# EAGLE design SHIELD-EKG-EMG_Rev_B (EAGLE 5.02)
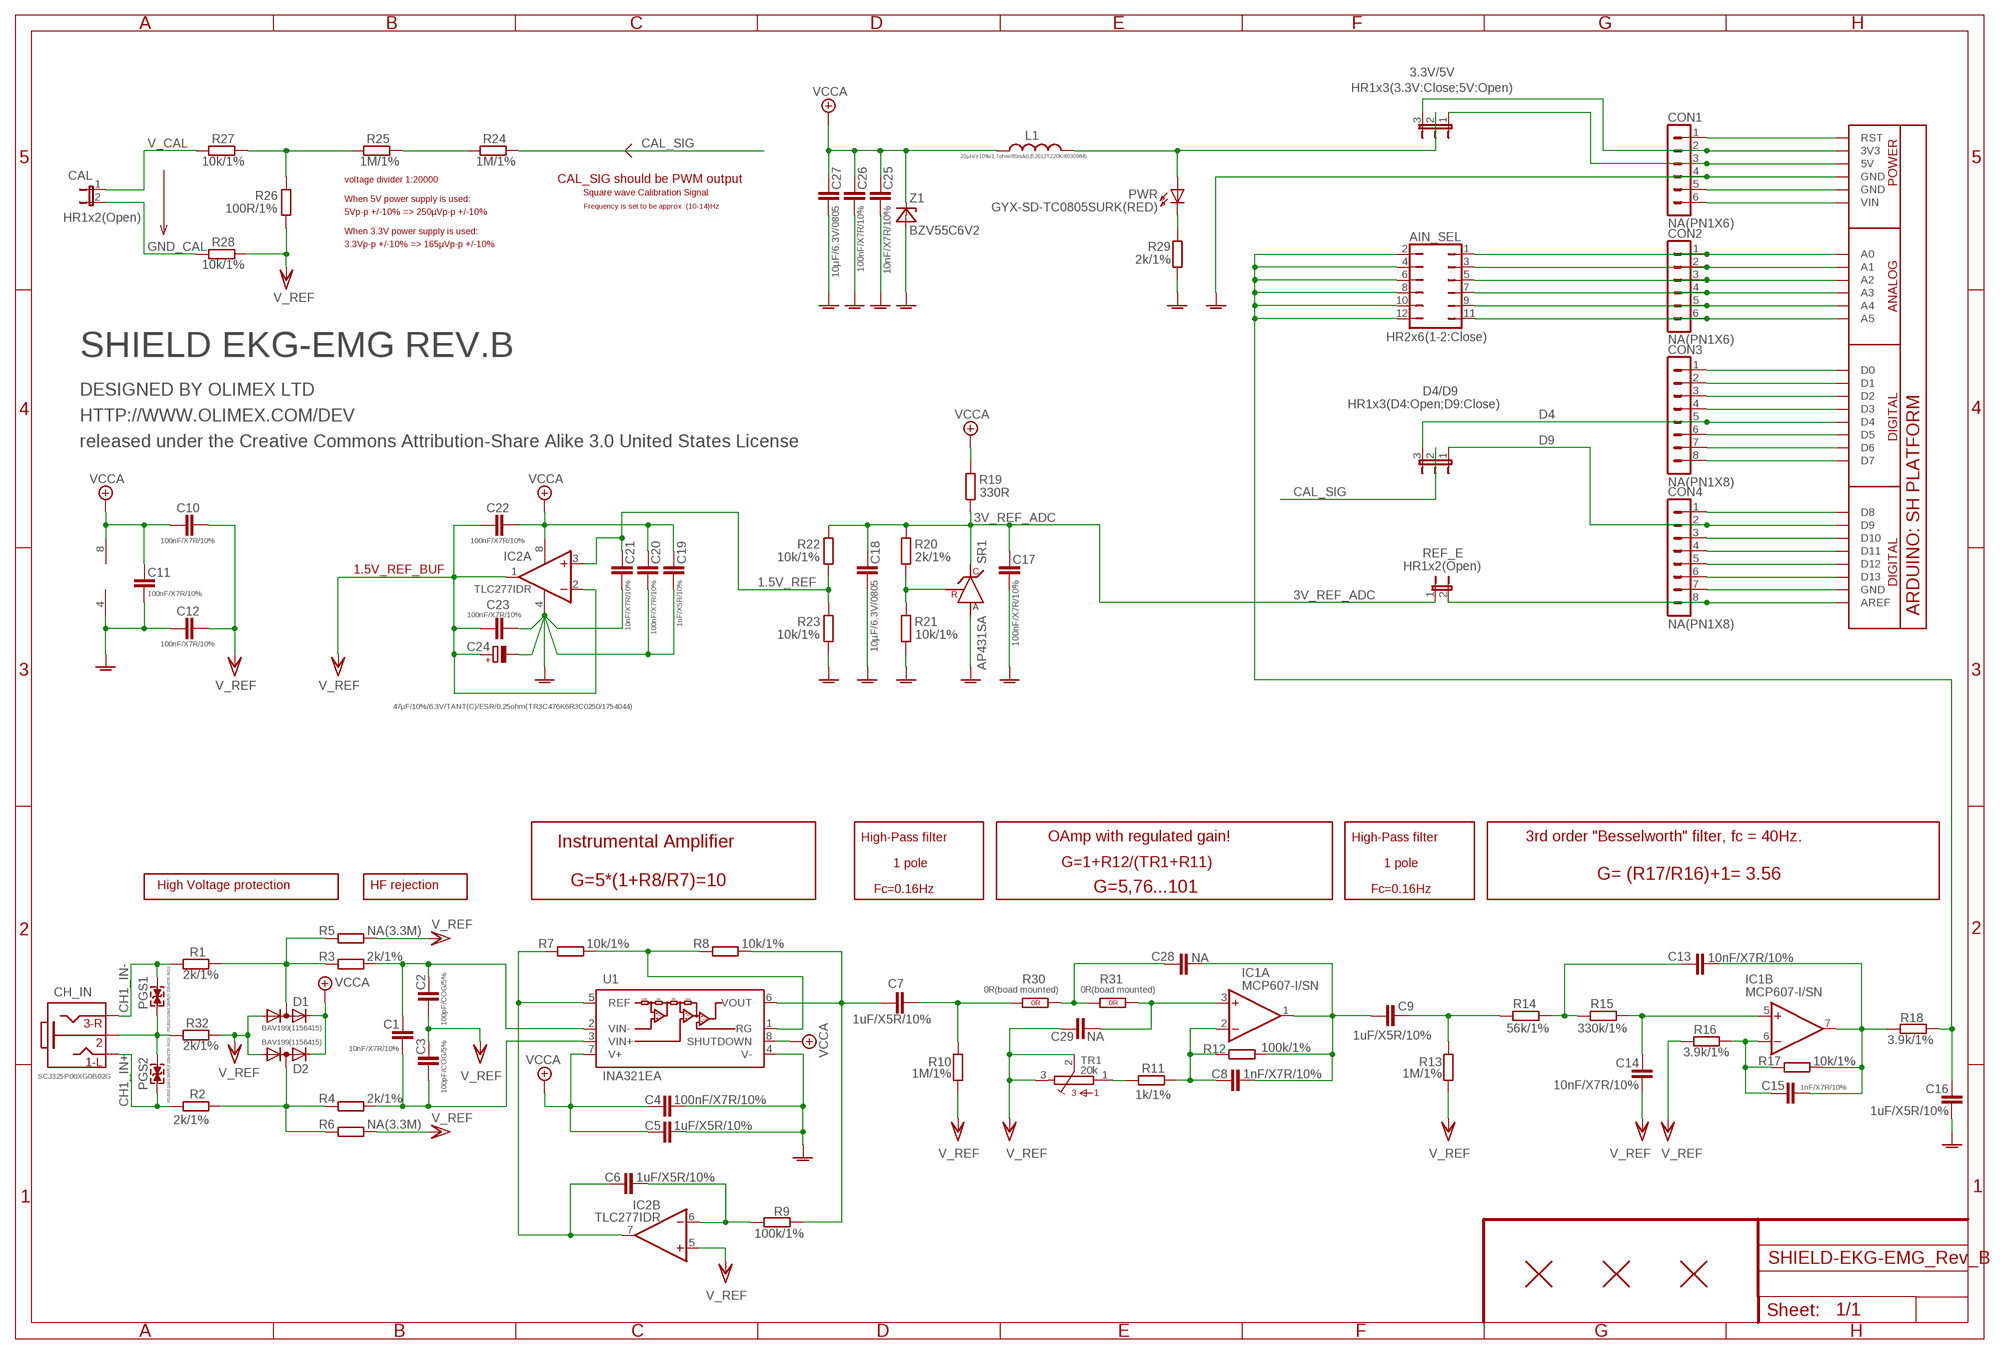
[diagram p0: schematic, sheet 1]

## Parts
3.3V/5V  HR1x3(3.3V:Close;5V:Open)  JP2EHR1X3  [HR1X3]
AIN_SEL  HR2x6(1-2:Close)  JP6QHR2X6  [HR2X6]
C1  10nF/X7R/10%  C-EUC0603_DWS  [C0603_DWS]
C2  100pF/COG/5%  C-EUC0603_DWS  [C0603_DWS]
C3  100pF/COG/5%  C-EUC0603_DWS  [C0603_DWS]
C4  100nF/X7R/10%  C-EUC0603_DWS  [C0603_DWS]
C5  1uF/X5R/10%  C-EUC0603_DWS  [C0603_DWS]
C6  1uF/X5R/10%  C-EUC0603_DWS  [C0603_DWS]
C7  1uF/X5R/10%  C-EUC0603_DWS  [C0603_DWS]
C8  1nF/X7R/10%  C-EUC0603_DWS  [C0603_DWS]
C9  1uF/X5R/10%  C-EUC0603_DWS  [C0603_DWS]
C10  100nF/X7R/10%  C-EUC0603_DWS  [C0603_DWS]
C11  100nF/X7R/10%  C-EUC0603_DWS  [C0603_DWS]
C12  100nF/X7R/10%  C-EUC0603_DWS  [C0603_DWS]
C13  10nF/X7R/10%  C-EUC0603_DWS  [C0603_DWS]
C14  10nF/X7R/10%  C-EUC0603_DWS  [C0603_DWS]
C15  1nF/X7R/10%  C-EUC0603_DWS  [C0603_DWS]
C16  1uF/X5R/10%  C-EUC0603_DWS  [C0603_DWS]
C17  100nF/X7R/10%  C-EUC0603_DWS  [C0603_DWS]
C18  10µF/6.3V/0805  C-EUC0805_5MIL_DWS  [C0805_5MIL_DWS]
C19  1uF/X5R/10%  C-EUC0603_DWS  [C0603_DWS]
C20  100nF/X7R/10%  C-EUC0603_DWS  [C0603_DWS]
C21  10nF/X7R/10%  C-EUC0603_DWS  [C0603_DWS]
C22  100nF/X7R/10%  C-EUC0603_DWS  [C0603_DWS]
C23  100nF/X7R/10%  C-EUC0603_DWS  [C0603_DWS]
C24  47µF/10%/6.3V/TANT(C)/ESR/0.25ohm(TR3C476K6R3C0250/1754044)  CPOL-EUCT6032  [CT6032]
C25  10nF/X7R/10%  C-EUC0603_DWS  [C0603_DWS]
C26  100nF/X7R/10%  C-EUC0603_DWS  [C0603_DWS]
C27  10µF/6.3V/0805  C-EUC0805_5MIL_DWS  [C0805_5MIL_DWS]
C28  NA  C-EUC0603_DWS_NA  [C0603_DWS_NA]
C29  NA  C-EUC0603_DWS_NA  [C0603_DWS_NA]
CAL  HR1x2(Open)  JP1EHR1X2  [JP1R]
CH_IN  SCJ325P00XG0B02G  JACK-3PINSCJ325P00XG0B02G  [PHONE_JACK-SMD]
CON1  NA(PN1X6)  CON6PN1X6  [PN1X6]
CON2  NA(PN1X6)  CON6PN1X6  [PN1X6]
CON3  NA(PN1X8)  CON8PN1X8  [PN1X8]
CON4  NA(PN1X8)  CON8PN1X8  [PN1X8]
D1  BAV199(1156415)  DIODE_AC-AC_  [SOT23C(BAT54S)]
D2  BAV199(1156415)  DIODE_AC-AC_  [SOT23C(BAT54S)]
D4/D9  HR1x3(D4:Open;D9:Close)  JP2EHR1X3  [HR1X3]
IC1  MCP607-I/SN  LM358D  [SO08]
IC2  TLC277IDR  LM358D  [SO08]
L1  22µH/±10%/1.7ohm/80mA(LB2012T220K/8030984)  L-USL0805_5MIL_DWS  [L0805_5MIL_DWS]
PGS1  PGB1010603MR(F2594TR-ND)  [0603]
PGS2  PGB1010603MR(F2594TR-ND)  [0603]
PWR  GYX-SD-TC0805SURK(RED)  LED0805DWS  [LED-0805]
R1  2k/1%  R-EU_R0603_5MIL_DWS  [R0603_5MIL_DWS]
R2  2k/1%  R-EU_R0603_5MIL_DWS  [R0603_5MIL_DWS]
R3  2k/1%  R-EU_R0603_5MIL_DWS  [R0603_5MIL_DWS]
R4  2k/1%  R-EU_R0603_5MIL_DWS  [R0603_5MIL_DWS]
R5  NA(3.3M)  R-EU_R0603_5MIL_DWS_NA  [R0603_5MIL_DWS_NA]
R6  NA(3.3M)  R-EU_R0603_5MIL_DWS_NA  [R0603_5MIL_DWS_NA]
R7  10k/1%  R-EU_R0603_5MIL_DWS  [R0603_5MIL_DWS]
R8  10k/1%  R-EU_R0603_5MIL_DWS  [R0603_5MIL_DWS]
R9  100k/1%  R-EU_R0603_5MIL_DWS  [R0603_5MIL_DWS]
R10  1M/1%  R-EU_R0603_5MIL_DWS  [R0603_5MIL_DWS]
R11  1k/1%  R-EU_R0603_5MIL_DWS  [R0603_5MIL_DWS]
R12  100k/1%  R-EU_R0603_5MIL_DWS  [R0603_5MIL_DWS]
R13  1M/1%  R-EU_R0603_5MIL_DWS  [R0603_5MIL_DWS]
R14  56k/1%  R-EU_R0603_5MIL_DWS  [R0603_5MIL_DWS]
R15  330k/1%  R-EU_R0603_5MIL_DWS  [R0603_5MIL_DWS]
R16  3.9k/1%  R-EU_R0603_5MIL_DWS  [R0603_5MIL_DWS]
R17  10k/1%  R-EU_R0603_5MIL_DWS  [R0603_5MIL_DWS]
R18  3.9k/1%  R-EU_R0603_5MIL_DWS  [R0603_5MIL_DWS]
R19  330R  R-EU_R0603_5MIL_DWS  [R0603_5MIL_DWS]
R20  2k/1%  R-EU_R0603_5MIL_DWS  [R0603_5MIL_DWS]
R21  10k/1%  R-EU_R0603_5MIL_DWS  [R0603_5MIL_DWS]
R22  10k/1%  R-EU_R0603_5MIL_DWS  [R0603_5MIL_DWS]
R23  10k/1%  R-EU_R0603_5MIL_DWS  [R0603_5MIL_DWS]
R24  1M/1%  R-EU_R0603_5MIL_DWS  [R0603_5MIL_DWS]
R25  1M/1%  R-EU_R0603_5MIL_DWS  [R0603_5MIL_DWS]
R26  100R/1%  R-EU_R0603_5MIL_DWS  [R0603_5MIL_DWS]
R27  10k/1%  R-EU_R0603_5MIL_DWS  [R0603_5MIL_DWS]
R28  10k/1%  R-EU_R0603_5MIL_DWS  [R0603_5MIL_DWS]
R29  2k/1%  R-EU_R0603_5MIL_DWS  [R0603_5MIL_DWS]
R30  0R(boad mounted)  R_0R0R(NA)  [0603_0R]
R31  0R(boad mounted)  R_0R0R(NA)  [0603_0R]
R32  2k/1%  R-EU_R0603_5MIL_DWS  [R0603_5MIL_DWS]
REF_E  HR1x2(Open)  JP1EHR1X2  [JP1R]
SR1  AP431SA  TL431'''  [SOT-23]
TR1  20k  S64Y  [S64Y]
U1  INA321EA  [MSOP8]
U2  2xPN1x6/8.5/11+2xPN1x8/8.5/11  ARDUINO_SH_PLATFORM1  [ARDUINO_SHIELD_PLATFORM]
U$5  FIDUCIAL1X2  [FIDUCIAL-1X2]
U$6  FIDUCIAL1X2  [FIDUCIAL-1X2]
U$7  FIDUCIAL1X2  [FIDUCIAL-1X2]
Z1  BZV55C6V2  ZDIOD-SMD  [MINI-MELF]

## Nets
1.5V_REF: C21.1 IC2.3(A:+IN) R22.1 R23.2
3V_REF_ADC: C17.1 C18.1 R19.1 R20.2 R22.2 REF_E.1 SR1.1(C)
+5V: C4.1 C5.1 C10.1 C11.1 C19.1 C20.1 C22.2 C25.1 C26.1 C27.1 D1.2(K) D2.2(K) IC1.8(P:V+) IC2.8(P:V+) L1.2 R19.2 U1.7(V+) U1.8(SHUTDOWN) Z1.1(C) ; supply symbol labelled VCCA
ADC0: AIN_SEL.2 AIN_SEL.4 AIN_SEL.6 AIN_SEL.8 AIN_SEL.10 AIN_SEL.12 C16.1 R18.1
CAL_SIG: D4/D9.2 R24.2
CH1_IN+: CH_IN.5 PGS2.1 R2.1
CH1_IN-: CH_IN.2 PGS1.2 R1.1
D4: CON3.5 D4/D9.3 U2.D4
D9: CON4.2 D4/D9.1 U2.D9
GND_CAL: CAL.2 R28.1
GNDA [pwr]: C4.2 C5.2 C11.2 C12.1 C16.2 C17.2 C18.2 C19.2 C20.2 C21.2 C23.2 C24.- C25.2 C26.2 C27.2 CON1.4 IC1.4(P:V-) IC2.4(P:V-) R21.1 R23.1 R29.1 SR1.3(A) U1.4(V-) U2.GND Z1.2(A)
N$1: CON4.8 REF_E.2 U2.AREF
N$2: 3.3V/5V.3 CON1.2 U2.3V3
N$3: 3.3V/5V.1 CON1.3 U2.5V
N$4: 3.3V/5V.2 L1.1 PWR.A
N$5: CON1.1 U2.RST
N$6: CON1.5 U2.GND@1(GND)
N$7: D1.3(AK) R1.2 R3.2 R5.2
N$8: D2.3(AK) R2.2 R4.2 R6.2
N$9: C6.2 IC2.7(B:OUT) R7.2 U1.5(REF)
N$10: R7.1 R8.2 U1.1(RG)
N$11: CON1.6 U2.VIN
N$12: CON3.1 U2.D0
N$14: AIN_SEL.1 CON2.1 U2.A0
N$15: PWR.C R29.2
N$16: CON3.2 U2.D1
N$17: CON3.3 U2.D2
N$18: CON3.4 U2.D3
N$19: AIN_SEL.3 CON2.2 U2.A1
N$20: C7.2 R10.1 R30.1(1.1)
N$21: CON3.6 U2.D5
N$22: R20.1 R21.2 SR1.2(R)
N$23: CON3.7 U2.D6
N$24: CON3.8 U2.D7
N$25: CON4.1 U2.D8
N$26: CON4.3 U2.D10
N$27: CON4.4 U2.D11
N$28: CON4.5 U2.D12
N$29: R11.2 TR1.1
N$30: CON4.6 U2.D13
N$31: AIN_SEL.5 CON2.3 U2.A2
N$32: AIN_SEL.7 CON2.4 U2.A3
N$33: AIN_SEL.9 CON2.5 U2.A4
N$34: AIN_SEL.11 CON2.6 U2.A5
N$35: CON4.7 U2.GND@2(GND)
N$36: C28.1 R30.2(1.2) R31.1(1.1)
N$37: CH_IN.1 PGS1.1 PGS2.2 R32.1
N$81: C9.2 R13.1 R14.1
N$83: C7.1 R8.1 R9.2 U1.6(VOUT)
N$92: C1.1 C3.1 R4.1 U1.3(VIN+)
N$93: C1.2 C2.2 R3.1 U1.2(VIN-)
N$102: C29.1 IC1.3(A:+IN) R31.2(1.2)
N$104: C8.2 C9.1 C28.2 IC1.1(A:OUT) R12.2
N$105: C8.1 IC1.2(A:-IN) R11.1 R12.1
N$107: C14.1 IC1.5(B:+IN) R15.2
N$108: C13.1 R14.2 R15.1
N$109: C13.2 C15.2 IC1.7(B:OUT) R17.2 R18.2
N$110: C15.1 IC1.6(B:-IN) R16.1 R17.1
N$144: R24.1 R25.2
N$145: C6.1 IC2.6(B:-IN) R9.1
N$146: R25.1 R26.2 R27.2
V_CAL: CAL.1 R27.1
VCC/2: C2.1 C3.2 C10.2 C12.2 C14.2 C22.1 C23.1 C24.+ C29.2 D1.1(A) D2.1(A) IC2.1(A:OUT) IC2.2(A:-IN) IC2.5(B:+IN) R5.1 R6.1 R10.2 R13.2 R16.2 R26.1 R28.2 R32.2 TR1.2 TR1.3 ; supply symbol labelled V_REF

## Notes on the sheet
- voltage divider 1:20000 | CAL_SIG should be PWM output
- Square wave Calibration Signal
- When 5V power supply is used:
- Frequency is set to be approx: (10-14)Hz
- 5Vp-p +/-10% => 250µVp-p +/-10%
- When 3.3V power supply is used:
- 3.3Vp-p +/-10% => 165µVp-p +/-10%
- SHIELD EKG-EMG REV.B
- DESIGNED BY OLIMEX LTD
- HTTP://WWW.OLIMEX.COM/DEV
- released under the Creative Commons Attribution-Share Alike 3.0 United States License
- 1.5V_REF_BUF
- High-Pass filter | OAmp with regulated gain! | High-Pass filter | 3rd order "Besselworth" filter, fc = 40Hz.
- Instrumental Amplifier
- 1 pole | G=1+R12/(TR1+R11) | 1 pole
- High Voltage protection | HF rejection | G= (R17/R16)+1= 3.56
- G=5*(1+R8/R7)=10
- Fc=0.16Hz | G=5,76...101 | Fc=0.16Hz

## Library data of the parts
3.3V/5V D4/D9 = jumper:JP2E: JUMPER
AIN_SEL = jumper:JP6Q: JUMPER
C1-C23 C25-C29 = rcl:C-EU: CAPACITOR, European symbol
C24 = rcl:CPOL-EU: POLARIZED CAPACITOR, European symbol
CAL REF_E = jumper:JP1E: JUMPER
CH_IN = gogo:JACK-3PIN
CON1 CON2 = Penko:CON6: CONNECTORS - 6 PINS
CON3 CON4 = Penko:CON8
D1 D2 = semicon-smd-ipc:DIODE_AC-AC_: DUAL DIODE
IC1 IC2 = linear:LM358: OP AMP
L1 = rcl:L-US: INDUCTOR, American symbol
PGS1 PGS2 = OLIMEX_DISCRET:PGB1010603MR: PulseGuard® Suppressors Surface Mount Polymeric ESD Suppressors
PWR = DOUBLE-SIDE:LED
R1-R29 R32 = rcl:R-EU_: RESISTOR, European symbol
R30 R31 = OLIMEX_DISCRET:R_0R
SR1 = OLIMEX_IC:TL431: TL431 Programmable Shunt Regulator Features: -> Programmable Output Voltage to 36 Volts -> Low Dynamic Output Impedance 0.20 Typical -> Sink Current Capability of 1.0 to 100mA -> Equivalent Full-Range Temperature Coefficient of 50ppm/°C Typical -> Temperature Compensated For Operation Over Full Rated Operating Temperature Range -> Low Output Noise Voltage -> Fast Turn-on Response
TR1 = TRIMPOT:S64Y
U1 = OLIMEX_IC:INA321
U2 = OLIMEX_CASES:ARDUINO_SH_PLATFORM
U$5-U$7 = SparkFunEagle-6-6-07:FIDUCIAL: Fiducial Alignment Points Various fiducial points for machine vision alignment.
Z1 = gogo:ZDIOD-SMD

## Net classes
1 pwr: width 0.4 mm, drill 0.6 mm, clearance 0.23 mm

## Board
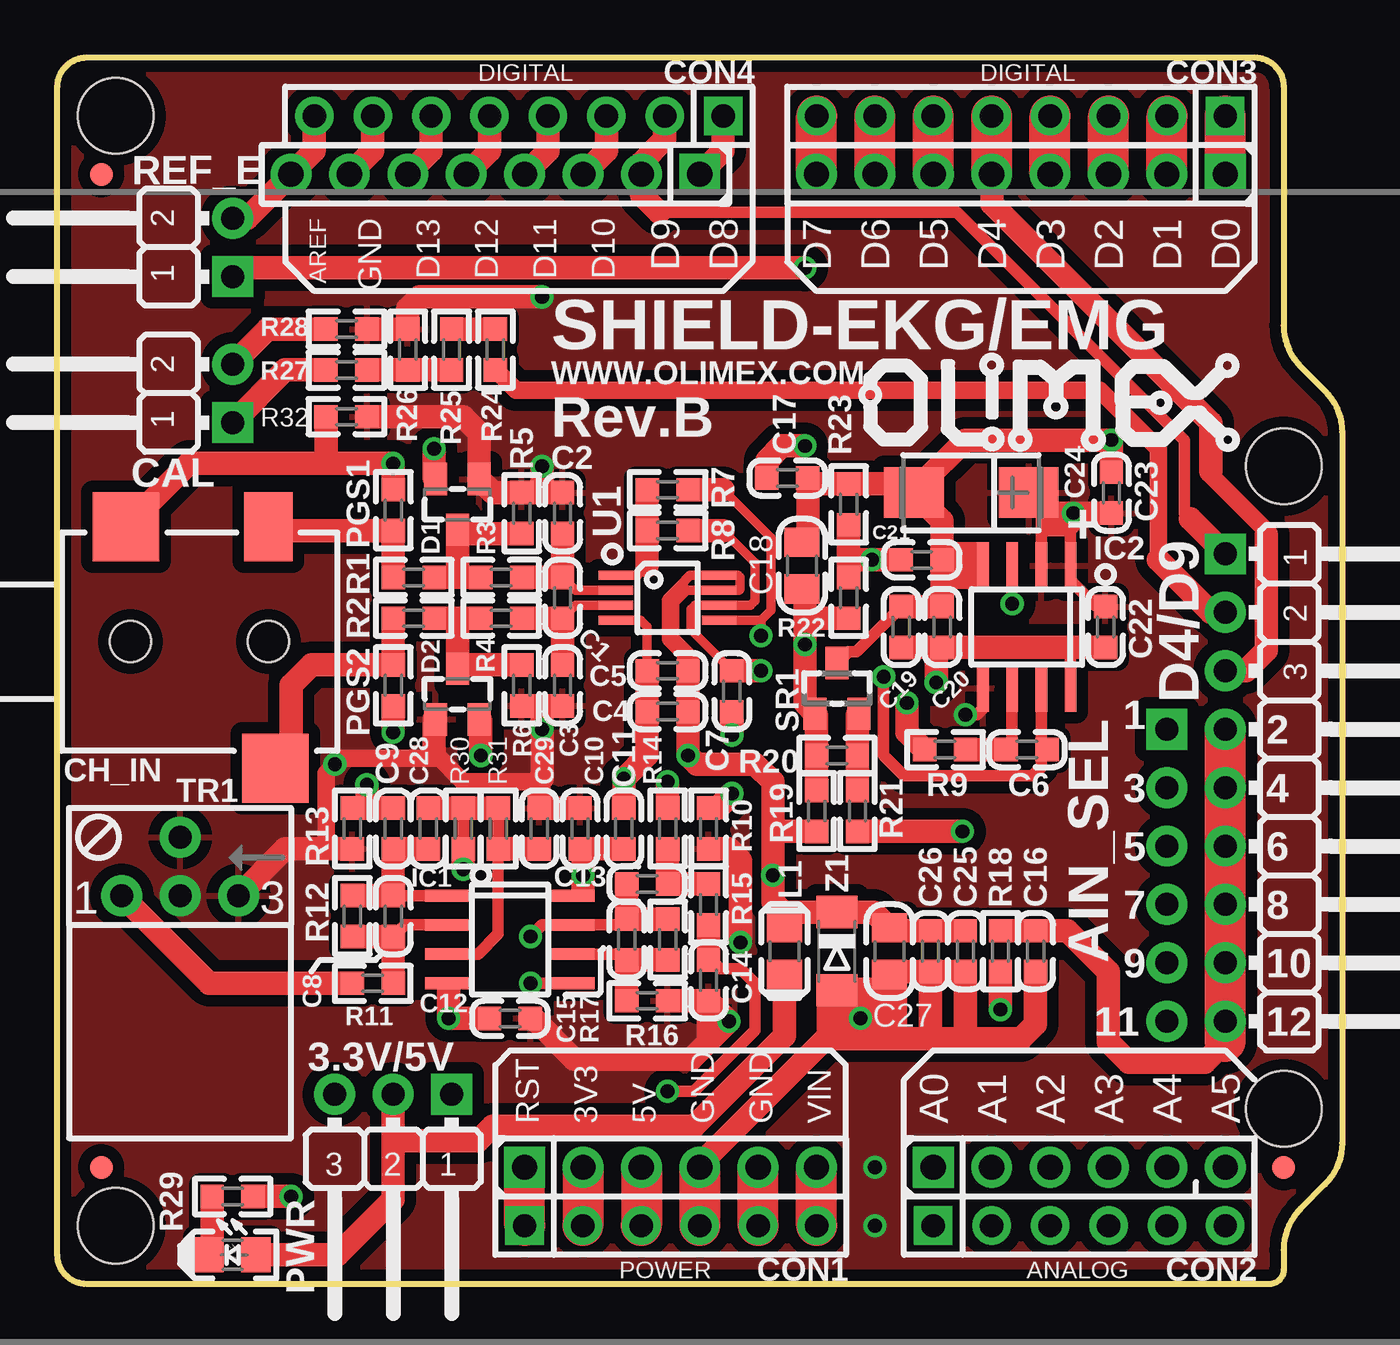
[diagram p1: board, top side]
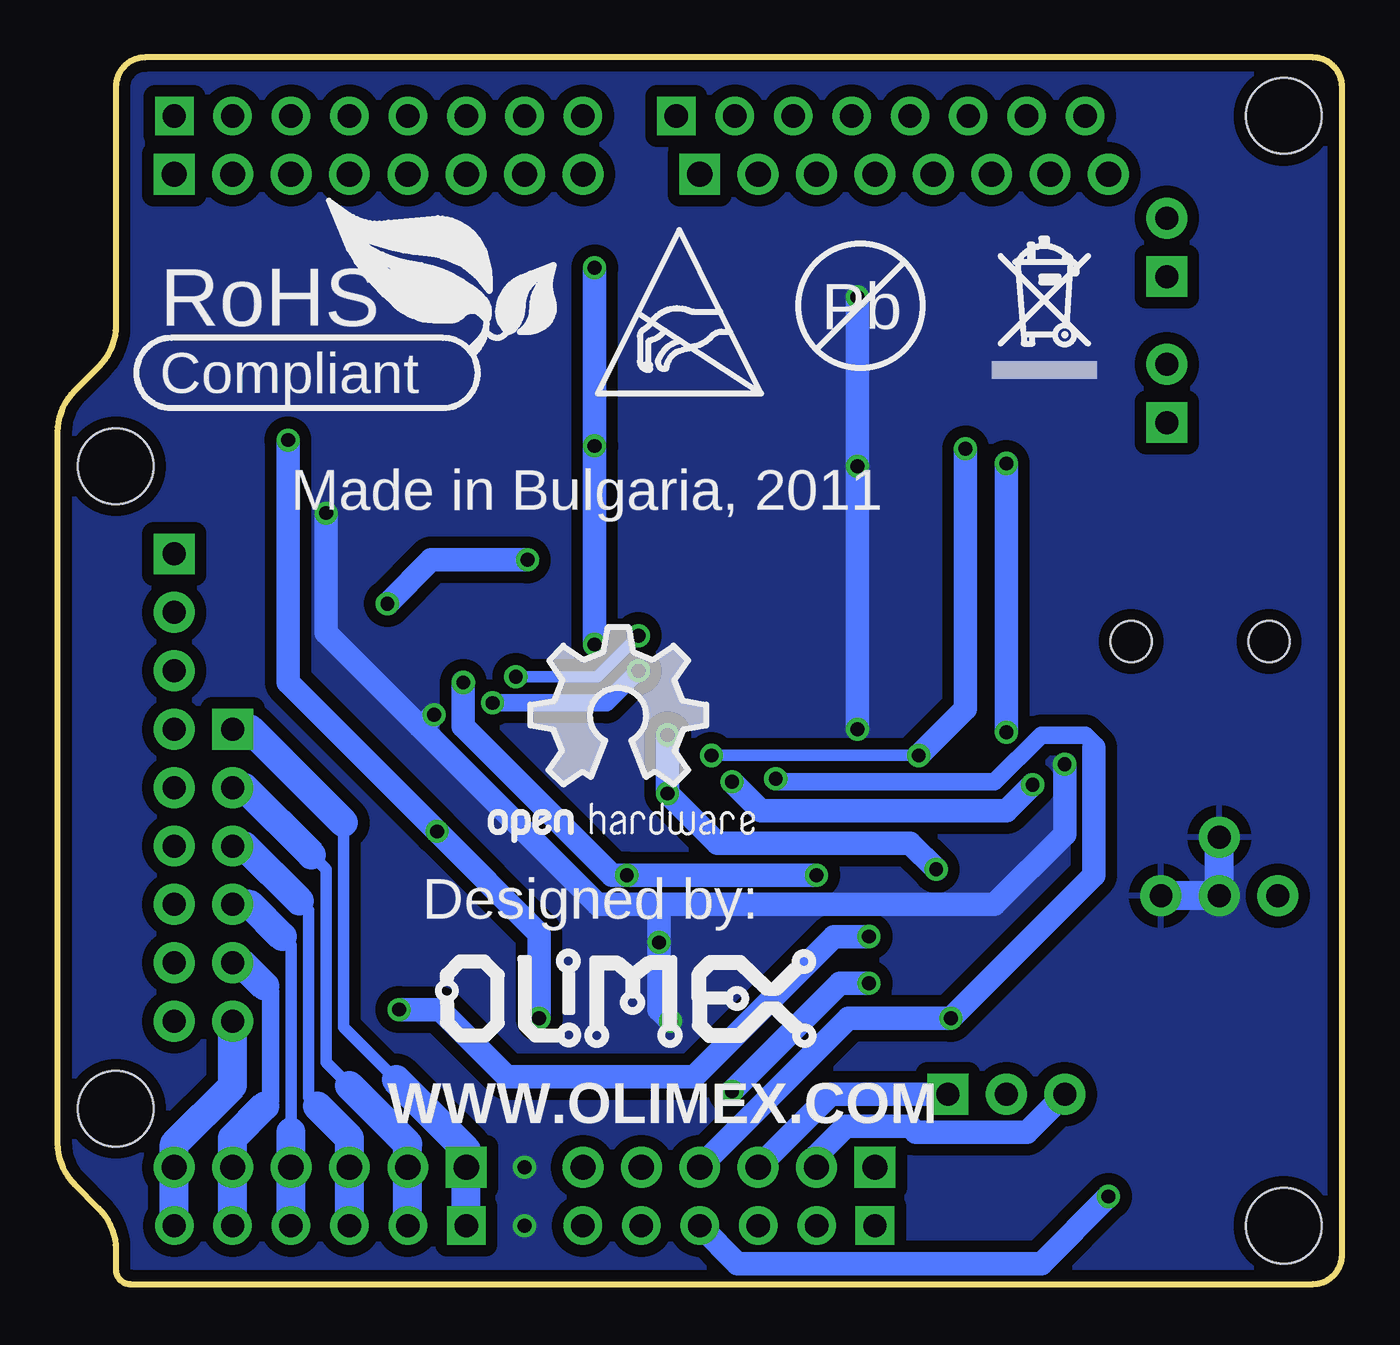
[diagram p2: board, bottom side, seen from below]

Size 55.88 x 53.34 mm. Coordinates in mm from the lower left corner, seen from the top.
Copper layers (1+16): Top 0.035mm / dielectric 1.5mm / Bottom 0.035mm
Design rules "default": minimum track width 10mil, minimum drill 0.6mm, track to track 9.5mil, track to pad 9.5mil, pad to pad 9.5mil, via to via 10mil, smd to smd 1mil, copper to edge 10mil, drill to drill 10mil, minimum pad ring 10mil, minimum via ring 8mil, stop-mask expansion 4mil, vias tented up to drill 25mil, thermal gap 20mil

### Footprints (pad centres in the part's own frame; a part is rotated, then mirrored left to right if it is on the bottom)
HR1X3 = drill 1 pad 1.778 square: 1 -2.54,0 | drill 1 pad 1.778 round: 2 0,0; 3 2.54,0
HR2X6 = drill 1 pad 1.778 square: 1 -6.35,-1.27 | drill 1 pad 1.778 round: 2 -6.35,1.27; 3 -3.81,-1.27; 4 -3.81,1.27; 5 -1.27,-1.27; 6 -1.27,1.27; 7 1.27,-1.27; 8 1.27,1.27; 9 3.81,-1.27; 10 3.81,1.27; 11 6.35,-1.27; 12 6.35,1.27
C0603_DWS = smd 1.016 x 1.016: 1 -0.889,0; 2 0.889,0
C0805_5MIL_DWS = smd 1.27 x 1.524: 1 -1.016,0; 2 1.016,0
CT6032 = smd 2.6 x 2.2: + -2.5,0; - 2.5,0
C0603_DWS_NA = smd 1.016 x 1.016: 1 -0.889,0; 2 0.889,0
JP1R = drill 1 pad 1.778 square: 1 -1.27,0 | drill 1 pad 1.778 round: 2 1.27,0
PHONE_JACK-SMD = smd 2.9 x 3: 1 -0.2,5; 5 6.3,-5.5 | smd 2.1 x 3: 2 6,5 | hole 1.8: 0,0; 6,0
PN1X6 = drill 1.1 pad 1.778 square: 1 -6.35,0 | drill 1.1 pad 1.778 round: 2 -3.81,0; 3 -1.27,0; 4 1.27,0; 5 3.81,0; 6 6.35,0
PN1X8 = drill 1.1 pad 1.778 square: 1 -8.89,0 | drill 1.1 pad 1.778 round: 2 -6.35,0; 3 -3.81,0; 4 -1.27,0; 5 1.27,0; 6 3.81,0; 7 6.35,0; 8 8.89,0
SOT23C(BAT54S) = smd 1 x 1.4: 1 -0.95,-1.1; 2 0.95,-1.1; 3 0,1.1
SO08 = smd 0.508 x 2.032: 1 -1.905,-2.667; 2 -0.635,-2.667; 3 0.635,-2.667; 4 1.905,-2.667; 5 1.905,2.667; 6 0.635,2.667; 7 -0.635,2.667; 8 -1.905,2.667
L0805_5MIL_DWS = smd 1.27 x 1.524: 1 -1.016,0; 2 1.016,0
0603 = smd 1.016 x 1.016: 1 -0.889,0; 2 0.889,0
LED-0805 = smd 1.27 x 1.524: A 1.016,0; C -1.016,0
R0603_5MIL_DWS = smd 1.016 x 1.016: 1 -0.889,0; 2 0.889,0
R0603_5MIL_DWS_NA = smd 1.016 x 1.016: 1 -0.889,0; 2 0.889,0
0603_0R = smd 1.016 x 1.016: 1 -0.889,0; 2 0.889,0
SOT-23 = smd 1 x 1.4: 1 -0.95,-1.1; 2 0.95,-1.1; 3 0,1.1
S64Y = drill 0.991 pad 1.778 round: 1 2.54,1.27; 2 0,-1.27; 3 -2.54,1.27
MSOP8 = smd 0.4 x 1.5: 1 -0.975,-2.25; 2 -0.325,-2.25; 3 0.325,-2.25; 4 0.975,-2.25; 5 0.975,2.25; 6 0.325,2.25; 7 -0.325,2.25; 8 -0.975,2.25
ARDUINO_SHIELD_PLATFORM = drill 1.016 pad 1.676 round: 3V3 22.86,2.54; 5V 25.4,2.54; A1 40.64,2.54; A2 43.18,2.54; A3 45.72,2.54; A4 48.26,2.54; A5 50.8,2.54; AREF 11.176,50.8; D1 48.26,50.8; D2 45.72,50.8; D3 43.18,50.8; D4 40.64,50.8; D5 38.1,50.8; D6 35.56,50.8; D7 33.02,50.8; D9 26.416,50.8; D10 23.876,50.8; D11 21.336,50.8; D12 18.796,50.8; D13 16.256,50.8; GND 27.94,2.54; GND@1 30.48,2.54; GND@2 13.716,50.8; VIN 33.02,2.54 | drill 1.016 pad 1.676 square: A0 38.1,2.54; D0 50.8,50.8; D8 28.956,50.8; RST 20.32,2.54 | hole 3.3: 53.34,35.56; 53.34,7.62; 2.54,50.8; 2.54,2.54
FIDUCIAL-1X2 = smd 1 x 1: 1 0,0
MINI-MELF = smd 1.4 x 1.8: 1 -1.7,0; 2 1.7,0

### Placement (x,y rotation side)
3.3V/5V  14.61,8.26 180 top
AIN_SEL  49.53,17.78 270 top
C1  21.97,29.84 90 top
C2  21.97,33.53 270 top
C3  21.97,26.04 270 top
C4  26.54,24.89 180 top
C5  26.54,26.67 180 top
C6  42.16,23.24 0 top
C7  29.34,25.78 270 top
C8  14.61,16 90 top
C9  14.61,19.81 90 top
C10  22.73,19.81 90 top
C11  24.64,19.81 90 top
C12  19.68,11.56 0 top
C13  25.65,17.4 180 top
C14  28.32,13.21 270 top
C15  24.77,14.99 90 top
C16  42.55,14.48 270 top
C17  31.75,35.05 0 top
C18  32.38,31.24 90 top
C19  36.7,28.57 90 top
C20  38.48,28.57 90 top
C21  37.59,31.5 0 top
C22  45.59,28.57 270 top
C23  45.85,34.42 90 top
C24  39.75,34.42 180 top
C25  39.5,14.48 270 top
C26  37.97,14.48 270 top
C27  36.2,14.48 270 top
C28  16.13,19.81 270 top
C29  20.95,19.81 90 top
CAL  7.62,38.73 90 top
CH_IN  3.17,27.94 0 top
CON1  26.67,5.08 0 top
CON2  44.45,5.08 0 top
CON3  41.91,48.26 180 top
CON4  19.05,48.26 180 top
D1  17.4,33.91 180 top
D2  17.4,25.65 0 top
D4/D9  50.8,29.21 270 top
IC1  19.68,14.99 270 top
IC2  42.16,28.57 180 top
L1  31.62,14.48 90 top
PGS1  14.61,33.66 270 top
PGS2  14.61,26.04 270 top
PWR  7.62,1.27 0 top
R1  15.49,30.73 0 top
R2  15.49,28.96 0 top
R3  19.3,30.73 180 top
R4  19.3,28.96 180 top
R5  20.19,33.53 270 top
R6  20.19,26.04 90 top
R7  26.54,34.54 0 top
R8  26.54,32.77 180 top
R9  38.61,23.24 180 top
R10  28.32,19.81 270 top
R11  13.72,13.08 180 top
R12  12.83,16 90 top
R13  12.83,19.81 270 top
R14  26.54,19.81 270 top
R15  28.32,16.51 270 top
R16  25.65,12.32 0 top
R17  26.54,14.99 90 top
R18  41.02,14.48 270 top
R19  33.02,20.57 270 top
R20  33.91,22.99 180 top
R21  34.8,20.57 90 top
R22  34.42,29.84 270 top
R23  34.42,33.91 270 top
R24  19.05,40.64 270 top
R25  17.14,40.64 90 top
R26  15.24,40.64 270 top
R27  12.57,39.75 0 top
R28  12.57,41.53 0 top
R29  7.62,3.81 180 top
R30  17.65,19.81 90 top
R31  19.18,19.81 270 top
R32  12.57,37.72 0 top
REF_E  7.62,45.09 90 top
SR1  33.91,25.91 0 top
TR1  5.33,18.16 180 top
U1  26.54,29.84 270 top
U2  0,0 0 top
U$2  [OLIMEX1_V]  52.58,36.07 0 top
U$4  [ESD_SYMBOL]  32.38,38.73 0 bottom
U$5  53.34,5.08 0 top
U$6  1.91,5.08 0 top
U$7  1.91,48.26 0 top
U$8  [OLIMEX1_V]  21.72,10.16 0 bottom
U$9  [LOGO-OPENHARDWARE_8X8]  31.5,24.64 0 bottom
U$11  [PB]  20.95,42.55 0 bottom
U$13  [RECYCLE_BIN1/8]  15.24,39.37 0 bottom
U$14  [ROHS]  51.44,38.73 0 bottom
Z1  33.91,14.48 270 top

### Tracks (layer width: path | path; a pad name or v marks a point on that pad's centre or on a via)
1.5V_REF  (via drill 0.6)
  Top 0.508: v41.53,29.59 IC2.3
  Top 1.016: C21.1 v35.43,31.5 34.42,31.5 | 34.42,31.5 R23.2 | R22.1 34.42,31.5
  Bottom 1.016: v35.43,31.5 39.62,31.5 v41.53,29.59
3V_REF_ADC  (via drill 0.6)
  Top 0.61: SR1.1 33.02,24.75
  Top 1.016: R19.1 R20.2 33.02,24.75 | 32.51,28.96 R22.2 | SR1.1 32.96,24.83 32.51,25.27 v32.51,27.81 32.51,28.96 | v32.51,36.45 31.5,36.45 30.86,35.81 C17.1 | 32.51,28.96 32.51,30.23 C18.1 | REF_E.1 8,44.2 v32.51,44.2
  Bottom 1.016: v32.51,27.81 v32.51,36.45 v32.51,44.2
+5V  (via drill 0.6, 0.6 pad 0.81)
  Top 0.305: IC1.8 22.86,16.89 22.86,17.14
  Top 0.406: 27.12,30.17 U1.7 29.64,30.17 29.69,30.23 29.69,30.73 29.61,30.82 U1.8 27.52,30.82 27.05,30.35
  Top 0.508: 44.07,27.69 IC2.8
  Top 0.762: 27.12,30.17 26.67,29.72 26.67,28.07 27.43,27.3 27.43,27.05
  Top 0.813: 31.62,16.13 31.67,16.18
  Top 1.016: 22.86,18.92 C11.1 | C25.1 C26.1 36.2,15.37 C27.1 35.51,16.18 Z1.1 31.67,16.18 | v16.38,36.32 16.38,35.08 D1.2 | 22.86,17.14 v22.86,17.78 22.86,18.92 | L1.2 31.62,16.13 31.11,16.64 v31.11,17.78 31.11,19.68 | 22.86,18.92 C10.1 | 27.43,27.05 C5.1 C4.1 v27.43,22.99 27.81,22.61 30.35,22.61 31.11,21.84 31.11,19.68 | 31.11,19.68 R19.2 | v38.23,26.16 38.23,27.69 | 38.23,27.69 C20.1 44.07,27.69 C22.2 | 38.23,27.69 C19.1 | D2.2 18.39,24.51 18.41,24.51 v18.41,22.99
  Bottom 0.508: v27.43,22.99 v18.41,22.99
  Bottom 1.016: v22.86,17.78 v31.11,17.78 31.75,17.78 38.23,24.26 v38.23,26.16 | v18.41,22.99 16.38,25.02 v16.38,36.32
ADC0
  Top 1.016: 50.8,10.54 49.91,9.65 46.61,9.65 45.72,10.54 45.72,13.59 43.94,15.37 C16.1 R18.1
  Top 1.778: AIN_SEL.2 AIN_SEL.4 AIN_SEL.6 AIN_SEL.8 AIN_SEL.10 AIN_SEL.12 50.8,10.54
CAL_SIG
  Top 0.762: 47.88,31.5 47.88,36.32 45.34,38.86 19.94,38.86 R24.2
  Top 1.016: D4/D9.2 50.16,29.21 47.88,31.5
CH1_IN+
  Top 1.016: R2.1 PGS2.1 11.05,26.92 10.16,26.04 10.16,22.44 CH_IN.5
CH1_IN-
  Top 1.016: R1.1 PGS1.2 9.18,32.77 CH_IN.2
D4
  Top 0.762: 52.58,32.59 52.58,32.77 50.16,35.18 50.16,35.36
  Top 1.016: D4/D9.3 51.69,26.67 52.58,27.56 52.58,32.59 | CON3.5 40.64,46.99 50.16,37.47 50.16,35.36
  Top 1.778: CON3.5 U2.D4
D9
  Top 0.406: 25.4,48.13 CON4.2
  Top 0.508: 49.28,33.27 49.02,33.53 49.02,36.7 39.12,46.61 26.16,46.61
  Top 1.016: CON4.2 25.4,48.77 26.42,49.78 U2.D9 | 49.28,33.27 D4/D9.1 | 25.4,48.13 25.4,47.37 26.16,46.61
GND_CAL
  Top 1.016: CAL.2 9.14,41.53 R28.1
GNDA  (via drill 0.6, 0.6 pad 0.81)
  Top 0.406: 37.21,34.54 37.25,34.5 C24.- | 40.01,30.73 40.26,30.73 IC2.4 | U1.4 25.36,28.87 25.65,28.57 25.65,26.54 C5.2
  Top 0.508: 17.02,12.83 IC1.4 | SR1.3 34.41,27.51 34.75,27.51 C19.2
  Top 0.61: 32.64,34.8 C17.2
  Top 1.016: R29.1 v10.16,3.81 | CON1.4 27.94,5.21 33.4,10.67 33.53,10.67 | 33.91,10.67 33.91,12.83 | 33.91,12.83 Z1.2 34.92,12.78 v34.92,11.56 34.92,10.67 | C16.2 42.55,11.3 41.91,10.67 39.5,10.67 | 33.53,10.67 33.91,10.67 | 33.91,10.67 34.92,10.67 | 34.92,10.67 35.69,10.67 | 36.45,10.67 37.97,10.67 | 37.97,10.67 39.5,10.67 | 37.97,10.67 C26.2 | C26.2 C25.2 39.5,10.67 | C12.1 v17.02,11.56 17.02,12.83 | C19.2 C20.2 38.48,30.73 | 37.25,34.8 R23.1 32.64,34.8 32.64,32.51 C18.2 | 38.48,30.73 40.01,30.73 | 25.65,26.54 C4.2 25.65,22.99 v24.64,21.97 C11.2 | C21.2 38.48,30.73 | C21.2 38.48,33.19 C24.- 37.25,34.8 | 37.25,34.8 37.59,34.8 39.5,36.7 v45.85,36.7 C23.2 | v39.37,19.68 R21.1 | C21.2 38.48,31.75 40.01,31.75 40.01,31.5 | 35.69,10.67 36.45,10.67 | 36.45,10.67 36.45,13.46 C27.2 36.2,13.59 C26.2 | 35.69,10.67 35.69,12.83 33.91,12.83 | 33.53,10.67 33.53,12.83
  Top 1.778: U2.GND CON1.4
  Bottom 0.61: CON1.4 27.94,5.21
  Bottom 0.762: 10.79,23.32 10.79,23.5 11.18,23.88 13.08,23.88 15.11,21.84 24.51,21.84 v24.64,21.97
  Bottom 1.016: v10.16,3.81 13.08,0.89 26.29,0.89 U2.GND | 27.94,5.21 27.81,5.21 21.46,11.56 v17.02,11.56 10.79,17.78 10.79,23.32 | v45.85,36.7 45.85,26.16 v39.37,19.68 34.92,15.24 v34.92,11.56
N$1
  Top 1.016: REF_E.2 8.26,46.35 CON4.8 11.18,49.28 U2.AREF
N$2
  Top 1.778: CON1.2 U2.3V3
  Bottom 1.016: 3.3V/5V.3 13.72,6.6 18.54,6.6 18.8,6.86 21.59,6.86 22.86,5.59 CON1.2
N$3
  Top 1.778: CON1.3 U2.5V
  Bottom 1.016: 3.3V/5V.1 22.23,8.26 CON1.3
N$4
  Top 1.016: L1.1 31.62,10.79 27.69,6.86 18.92,6.86 18.29,6.22 14.61,6.22 | 14.61,6.22 3.3V/5V.2 | PWR.A 12.19,1.27 14.61,3.68 14.61,6.22
N$5
  Top 1.778: U2.RST CON1.1
N$6
  Top 1.778: U2.GND@1 CON1.5
N$7
  Top 0.254: D1.3 17.4,32.77
  Top 1.016: 17.4,30.73 R1.2 | 17.4,32.77 17.4,32.64 | 17.4,32.64 R5.2 | 17.4,32.64 17.4,30.73 | 17.4,30.73 R3.2
N$8
  Top 0.254: D2.3 17.4,26.92
  Top 1.016: 17.4,28.96 R2.2 | 17.4,28.96 R4.2 | 17.4,28.96 17.4,26.92 R6.2
N$9  (via drill 0.6)
  Top 0.406: 30.61,28.87 v30.61,28.19 | U1.5 30.61,28.87 | 30.61,28.87 31.04,29.3 31.04,32.46 28.96,34.54
  Top 0.508: 42.8,23.24 42.8,22.48 42.42,22.1 36.83,22.1 35.94,22.99 v35.94,26.42 | 42.8,23.24 IC2.7 | 42.8,23.24 C6.2
  Top 1.016: 28.96,34.54 R7.2
  Bottom 0.508: v30.61,28.19 32.38,26.42 v35.94,26.42
N$10
  Top 0.406: U1.1 25.23,30.82 25.65,31.24
  Top 1.016: 25.65,31.24 R8.2 R7.1
N$11
  Top 1.778: U2.VIN CON1.6
N$12
  Top 1.778: CON3.1 U2.D0
N$14
  Bottom 0.508: 43.43,20.07 43.43,11.18 41.15,8.89
  Bottom 1.27: U2.A0 CON2.1 38.1,5.84 41.15,8.89 | 43.43,20.07 47.5,24.13 AIN_SEL.1
N$15
  Top 1.016: PWR.C 6.73,1.27 R29.2
N$16
  Top 1.778: CON3.2 U2.D1
N$17
  Top 1.778: CON3.3 U2.D2
N$18
  Top 1.778: CON3.4 U2.D3
N$19
  Bottom 0.508: 44.83,18.67 44.2,18.03 44.2,9.65 43.18,8.64
  Bottom 1.27: U2.A1 CON2.2 40.64,6.1 43.18,8.64 | 44.83,18.67 47.75,21.59 AIN_SEL.3
N$20  (via drill 0.6)
  Top 1.016: R30.1 v17.65,18.03 | v29.34,23.88 C7.2 | v29.34,21.34 28.7,20.7 R10.1
  Bottom 1.016: v17.65,18.03 18.8,19.18 27.18,19.18 v29.34,21.34 v29.34,23.88
N$21
  Top 1.778: CON3.6 U2.D5
N$22
  Top 0.406: R20.1 34.8,23.11 | 34.86,24.83 34.92,24.89 | 34.86,24.83 SR1.2 | 34.8,24.77 34.86,24.83
  Top 1.016: R21.2 R20.1 34.8,24.77
N$23
  Top 1.778: CON3.7 U2.D6
N$24
  Top 1.778: CON3.8 U2.D7
N$25
  Top 1.016: CON4.1 28.96,49.28 U2.D8
N$26
  Top 1.016: CON4.3 23.88,49.28 U2.D10
N$27
  Top 1.016: CON4.4 21.34,49.28 U2.D11
N$28
  Top 1.016: CON4.5 18.8,49.28 U2.D12
N$29
  Top 1.016: TR1.1 6.6,13.08 R11.2
N$30
  Top 1.016: CON4.6 16.26,49.28 U2.D13
N$31
  Bottom 0.508: 45.36,16.66 44.96,16.26 44.96,8.13 44.58,7.75
  Bottom 1.27: U2.A2 CON2.3 43.18,6.35 44.58,7.75 | 45.36,16.66 47.75,19.05 AIN_SEL.5
N$32
  Bottom 0.508: 45.72,6.6 45.72,14.73 46.1,15.11
  Bottom 1.27: U2.A3 CON2.4 45.72,6.6 | 46.1,15.11 47.5,16.51 AIN_SEL.7
N$33
  Bottom 0.508: 46.86,7.75 46.61,8
  Bottom 0.762: 46.61,8 46.61,12.7 46.86,12.95
  Bottom 1.27: U2.A4 CON2.5 48.26,6.35 46.86,7.75 | 46.86,12.95 47.88,13.97 AIN_SEL.9
N$34
  Bottom 1.27: U2.A5 CON2.6 50.8,6.1 48.26,8.64 AIN_SEL.11
N$35
  Top 1.016: CON4.7 13.72,49.28 U2.GND@2
N$36
  Top 1.016: C28.1 R30.2 R31.1
N$37  (via drill 0.6)
  Top 1.016: CH_IN.1 5.72,35.69 11.68,35.69 | 11.68,35.69 v14.61,35.69 PGS1.1 | v14.61,24 PGS2.2 | 11.68,35.69 R32.1
  Bottom 1.016: v14.61,35.69 v14.61,24
N$81  (via drill 0.6)
  Top 1.016: R13.1 13.46,20.7 | 13.46,20.7 C9.2 | 13.46,20.7 v13.46,21.72 | v26.54,21.84 R14.1
  Bottom 1.016: v13.46,21.72 14.61,20.57 25.27,20.57 v26.54,21.84
N$83  (via drill 0.6)
  Top 0.406: C7.1 27.56,28.45 27.56,29.34 27.74,29.52 U1.6 30.16,29.52 30.35,29.72 30.35,31.37 28.96,32.77
  Top 1.016: C7.1 v30.61,26.67 | R9.2 36.96,24 v36.96,25.27 | 28.96,32.77 R8.1
  Bottom 0.762: v30.61,26.67 32,25.27 v36.96,25.27
N$92
  Top 0.406: U1.3 22.54,29.52 C1.1
  Top 1.016: R4.1 C1.1 C3.1
N$93
  Top 0.406: U1.2 22.54,30.17 C1.2
  Top 1.016: R3.1 C1.2 C2.2
N$102
  Top 0.508: IC1.3 18.29,14.35 19.18,15.24 R31.2
  Top 1.016: R31.2 C29.1
N$104
  Top 0.508: C8.2 IC1.1
  Top 1.016: R12.2 C8.2 C9.1 C28.2
N$105
  Top 0.508: C8.1 15.11,15.62 IC1.2
  Top 1.016: R12.1 C8.1 R11.1
N$107  (via drill 0.6)
  Top 0.254: 28.45,14.22 C14.1
  Top 0.508: IC1.5 v20.57,13.08 | v26.54,8.38 27.69,8.38 30.35,11.05 30.35,13.08 29.72,13.72 28.83,13.72 28.45,14.1 28.45,14.22
  Top 1.016: C14.1 R15.2
  Bottom 1.016: v20.57,13.08 21.84,13.08 v26.54,8.38
N$108
  Top 1.016: R15.1 C13.1 R14.2
N$109  (via drill 0.6)
  Top 0.254: C15.2 24.51,15.62
  Top 0.406: 24.77,15.62 C15.2
  Top 0.508: v20.57,15.11 21.08,15.62 IC1.7 24.77,15.62
  Top 1.016: C13.2 C15.2 R17.2 | v41.02,11.94 R18.2
  Bottom 1.016: v41.02,11.94 39.24,11.94 36.32,9.02 28.19,9.02 22.1,15.11 v20.57,15.11
N$110
  Top 0.406: 24.51,14.35 C15.1
  Top 0.508: IC1.6 24.51,14.35
  Top 1.016: R17.1 C15.1 R16.1
N$144
  Top 1.016: R25.2 R24.1
N$145
  Top 0.508: C6.1 41.53,23.5 IC2.6
  Top 1.016: R9.1 C6.1
N$146
  Top 1.016: R27.2 R26.2 R25.1
V_CAL
  Top 1.016: CAL.1 9.91,39.75 R27.1
VCC/2  (via drill 0.6, 0.6 pad 0.81, 1 pad 1.78)
  Top 0.406: 20.95,21.08 C29.2
  Top 0.508: C22.1 45.21,29.46 44.07,30.61 IC2.1 44.07,32.77 | 42.8,32.77 IC2.2 | 44.07,32.77 42.8,32.77 | 42.8,32.77 42.8,33.27 | v39.5,24.77 40.01,24.77 40.26,25.02 IC2.5 | 44.2,33.27 44.2,32.89 44.07,32.77
  Top 0.762: 20.7,11.56 C12.2 | 20.95,21.84 17.65,21.84 16.51,22.99 16.38,22.99 16.38,22.86 12.32,22.86 v12.06,22.61 11.68,22.23 11.68,18.92
  Top 1.016: C29.2 C10.2 | R28.2 R26.1 15.24,42.42 15.75,42.93 v21.08,42.93 | 28.32,10.54 v29.21,11.43 C14.2 | 28.32,10.54 C14.2 | 28.32,10.54 27.56,9.78 22.48,9.78 20.7,11.56 | R13.2 11.68,18.92 9.91,18.92 TR1.3 | R10.2 29.21,18.92 29.72,18.41 v29.72,14.86 | 21.08,25.15 R6.1 | v21.08,35.56 21.08,34.42 | 21.08,25.15 C3.2 | 21.08,25.15 v21.08,24.13 | 20.95,21.08 20.95,21.84 21.08,21.97 21.08,25.15 | C24.+ 43.14,33.53 v44.2,33.53 | v44.2,33.53 44.2,33.27 | v44.2,33.53 C23.1 | 21.08,34.42 R5.1 18.94,34.42 D1.1 18.35,37.02 17.65,37.72 R32.2 | 21.08,34.42 C2.1 | D2.1 16.38,24.55 16.38,22.99 | C14.2 R16.2
  Bottom 1.016: v29.21,11.43 29.72,11.94 v29.72,14.86 29.72,16.51 | 29.72,16.51 32.38,16.51 40.13,24.26 | v21.08,24.13 v21.08,35.56 v21.08,42.93 | v44.2,33.53 44.2,28.32 40.13,24.26 | v12.06,22.61 12.06,19.56 15.11,16.51 29.72,16.51 | 40.13,24.26 40.01,24.26 v39.5,24.77
  Bottom 1.27: TR1.2 v5.33,16.89 TR1.3
  other vias: 35.56,5.08 35.56,2.54
  pour Top (isolate 0.508): -2.54,55.88 58.42,55.88 58.42,-2.54 -2.54,-2.54
  pour Bottom (isolate 0.508): -5.08,58.42 60.96,58.42 60.96,-5.08 -5.08,-5.08

### Text on the board
tPlace: 1 | 2 | 3 | 4 | 5 | 6 | 7 | 8 | 9 | 10 | 11 | 12
tNames: SHIELD-EKG/EMG | WWW.OLIMEX.COM | Rev.B | +
bNames: Made in Bulgaria, 2011 | Designed by: | WWW.OLIMEX.COM